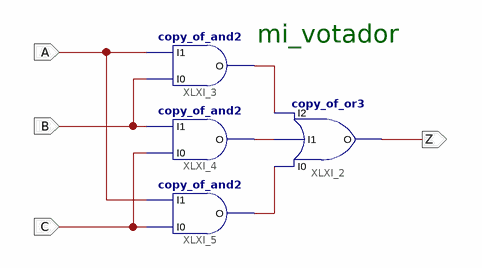
[diagram p0: schematic sheet 1]
// Xilinx ISE schematic sch_votador.sch (artix7) as structural Verilog: 4 symbols, 4 ports
module sch_votador (
  input  A,
  input  B,
  input  C,
  output Z
);

  wire XLXN_1, XLXN_3, XLXN_6;

  copy_of_and2 XLXI_4 (.I0(C), .I1(B), .O(XLXN_3));
  copy_of_and2 XLXI_3 (.I0(B), .I1(A), .O(XLXN_1));
  copy_of_and2 XLXI_5 (.I0(C), .I1(A), .O(XLXN_6));
  copy_of_or3 XLXI_2 (.I0(XLXN_6), .I1(XLXN_3), .I2(XLXN_1), .O(Z));

  // Notes on the sheet:
  //   mi_votador
endmodule
